# Altium schematic sheet [8]_DAC and MIC.SchDoc
size A; SheetNumber: 8; SheetTotal: 8
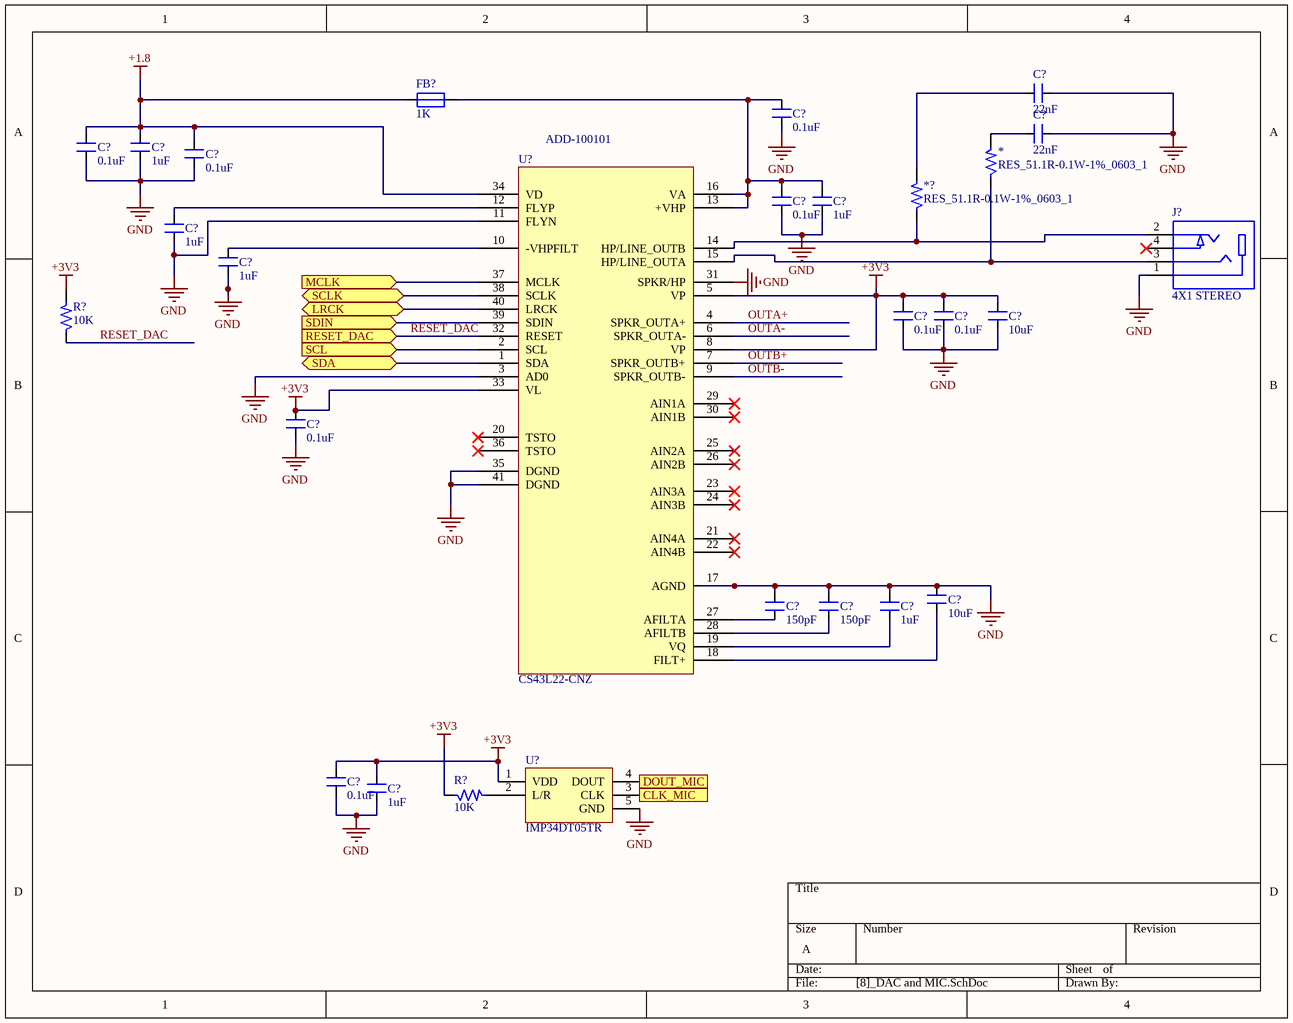
[diagram p0: [8]_DAC and MIC.SchDoc]

## Parts
(Parts that share a designator on the sheet are numbered #1, #2 ... from top to bottom, then left to right.)
*  RES_51.1R-0.1W-1%_0603_1
*?  RES_51.1R-0.1W-1%_0603_1
C?#1  22nF  [CAP_0805]
C?#2  0.1uF  [CAP_0805]
C?#3  22nF  [CAP_0805]
C?#4  0.1uF  [CAP_0805]
C?#5  1uF  [CAP_0805]
C?#6  0.1uF  [CAP_0805]
C?#7  0.1uF  [CAP_0805]
C?#8  1uF  [CAP_0805]
C?#9  1uF  [CAP_0805]
C?#10  1uF  [CAP_0805]
C?#11  0.1uF  [CAP_0805]
C?#12  0.1uF  [CAP_0805]
C?#13  10uF  [CAP_1206]
C?#14  0.1uF  [CAP_0805]
C?#15  10uF  [CAP_1206]
C?#16  150pF
C?#17  150pF
C?#18  1uF  [CAP_0805]
C?#19  0.1uF  [CAP_0805]
C?#20  1uF  [CAP_0805]
FB?  1K  [IND_0805]
J?  4X1 STEREO  [CON_SJ-2504A-SMT-TR_SMD]
R?#1  10K  [RES_0603]
R?#2  10K  [RES_0603]
U?#1  CS43L22-CNZ  [QFN40_19_284_33X9_SMD]
U?#2  IMP34DT05TR  [HCLGA-4_53_137_15X37_SMD]

## Ports
CLK_MIC, DOUT_MIC, LRCK (bidir), MCLK (in), RESET_DAC (in), SCL (in), SCLK (bidir), SDA (bidir), SDIN (in)

## Nets
+1.8: C?#4.2 C?#5.2 C?#6.2 FB?.1 U?#1.34(VD)
+3V3: C?#11.2 C?#12.2 C?#13.2 C?#14.2 C?#19.2 C?#20.2 R?#1.2 R?#2.1 U?#1.5(VP) U?#1.8(VP) U?#1.33(VL) U?#2.1(VDD)
GND: C?#1.2 C?#2.1 C?#3.2 C?#4.1 C?#5.1 C?#6.1 C?#7.1 C?#8.1 C?#9.1 C?#10.1 C?#11.1 C?#12.1 C?#13.1 C?#14.1 C?#15.2 C?#16.2 C?#17.2 C?#18.2 C?#19.1 C?#20.1 J?.1 U?#1.3(AD0) U?#1.11(FLYN) U?#1.17(AGND) U?#1.31(SPKR/HP) U?#1.35(DGND) U?#1.41(DGND) U?#2.5(GND)
CLK_MIC: U?#2.3(CLK) ; port CLK_MIC
DOUT_MIC: U?#2.4(DOUT) ; port DOUT_MIC
LRCK: U?#1.40(LRCK) ; port LRCK
MCLK: U?#1.37(MCLK) ; port MCLK
OUTA+: U?#1.4(SPKR_OUTA+)
OUTA-: U?#1.6(SPKR_OUTA-)
OUTB+: U?#1.7(SPKR_OUTB+)
OUTB-: U?#1.9(SPKR_OUTB-)
RESET_DAC: R?#1.1 U?#1.32(RESET) ; port RESET_DAC
SCL: U?#1.2(SCL) ; port SCL
SCLK: U?#1.38(SCLK) ; port SCLK
SDA: U?#1.1(SDA) ; port SDA
SDIN: U?#1.39(SDIN) ; port SDIN
Net*?_1: *?.1 J?.2 U?#1.14(HP/LINE_OUTB)
Net*?_2: *?.2 C?#1.1
Net*_1: *.1 J?.3 U?#1.15(HP/LINE_OUTA)
Net*_2: *.2 C?#3.1
NetC?#2_2: C?#2.2 C?#7.2 C?#8.2 FB?.2 U?#1.13(+VHP) U?#1.16(VA)
NetC?#9_2: C?#9.2 U?#1.12(FLYP)
NetC?#10_2: C?#10.2 U?#1.10(-VHPFILT)
NetC?#15_1: C?#15.1 U?#1.18(FILT+)
NetC?#16_1: C?#16.1 U?#1.27(AFILTA)
NetC?#17_1: C?#17.1 U?#1.28(AFILTB)
NetC?#18_1: C?#18.1 U?#1.19(VQ)
NetR?#2_2: R?#2.2 U?#2.2(L/R)

Not connected (* = marked no-connect by the designer): J? 4*; U?#1 20(TSTO)* 21(AIN4A)* 22(AIN4B)* 23(AIN3A)* 24(AIN3B)* 25(AIN2A)* 26(AIN2B)* 29(AIN1A)* 30(AIN1B)* 36(TSTO)*

## Notes on the sheet
- (near U?#1) ADD-100101

## Library data of the parts
C?#1 C?#3 = CAP_22nF-50V-10%-0805: 0.022µF ±10% 50V Ceramic Capacitor X7R 0805 (2012 Metric); Manufacturer: Samsung Electro-Mechanics; Manufacturer Part Number: CL21B223KBANNNC; Alternate Part Number-1: NA; Case/Package: 0805; Supplier-1: Digikey; Supplier Part Number-1: 1276-1081-1-ND - Cut Tape (CT)
C?#2 C?#4 C?#6 C?#7 C?#11 C?#12 C?#14 C?#19 = CAP_0.1uF-50V-10%-0805: 0.1µF ±10% 50V Ceramic Capacitor X7R 0805 (2012 Metric); Manufacturer: Samsung; Manufacturer Part Number: CL21B104KBCNNNC; Alternate Part Number-1: NA; Case/Package: 0805; Supplier-1: SIRICOM; Supplier Part Number-1: 0805B104K500CT
C?#5 C?#8-C?#10 C?#18 C?#20 = CAP_1uF-50V-5%-0805: 1µF ±5% 50V Ceramic Capacitor X7R 0805 (2012 Metric); Manufacturer: Samsung; Manufacturer Part Number: CC0805JKX7R9BB105; Alternate Part Number-1: 0805F105M500NT; Case/Package: 0805; Supplier-1: SIRICOM; Supplier Part Number-1: CL21B105KBFNNNE
C?#13 C?#15 = CAP_10uF-50V-10%-1206: 10µF ±10% 50V Ceramic Capacitor X7R 1206 (3216 Metric); Manufacturer: KEMET; Manufacturer Part Number: CL31B106KBHNNNE; Alternate Part Number-1: GRT31CR61H106ME01L; Case/Package: 1206; Supplier-1: SIRICOM; Supplier Part Number-1: CC1206KKX5R9BB106
C?#16 C?#17 = CAP_150pF-50V10%-0805_1
FB? = FB_1K-100MHZ-1.6A-0805: 1 kOhms @ 100MHz 1 Power Line Ferrite Bead 0805 (2012 Metric) 1.6A; Manufacturer: Laird; Manufacturer Part Number: BLM21SP102SH1D; Alternate Part Number-1: NA; Case/Package: 0805; Supplier-1: SIRICOM; Supplier Part Number-1: ACMS201209A102
J? = CON-PLG-STEREO_4X1-100-RA-SMD: 2.50mm (0.094", 3/32", Sub Mini, Miniature) - Headphone Phone Jack Stereo (4 Conductor, TRRS) Connector Solder; Manufacturer: CUI Devices; Manufacturer Part Number: SJ-2504A-SMT-TR; Alternate Part Number-1: NA; Case/Package: SMD; Supplier Part Number-1: CP-SJ-2504A-SMT-CT-ND - Cut Tape (CT); Supplier-1: Digikey
R?#1 R?#2 = RES_10K-0.1W-1%-0603: 10 kOhms ±1% 0.1W, 1/10W Chip Resistor 0603 (1608 Metric) Automotive AEC-Q200 Thick Film; Manufacturer: Walsin; Manufacturer Part Number: WR06X1002FTL; Alternate Part Number-1: 0603WAJ0103T5E; Case/Package: 0603; Supplier-1: SIRICOM; Supplier Part Number-1: WR06X1002FTL
U?#1 = IC_CS43L22: Audio D/A Converter ICs Low Power Stereo DAC w/ClassD Spkr Driver; Manufacturer: Cirrus Logic; Alternate Part Number-1: NA; Manufacturer Part Number: CS43L22-CNZ; Case/Package: QFN-40; Supplier-1: Mouser; Supplier Part Number-1: 777-CS43L22-CNZ
U?#2 = IC_IMP34DT05TR: MEMS Microphones AUTO & INDUSTRIAL SENSORS; Manufacturer: STMicroelectronics; Alternate Part Number-1: NA; Manufacturer Part Number: IMP34DT05TR; Case/Package: HCLGA-4; Supplier-1: Mouser; Supplier Part Number-1: 511-IMP34DT05TR